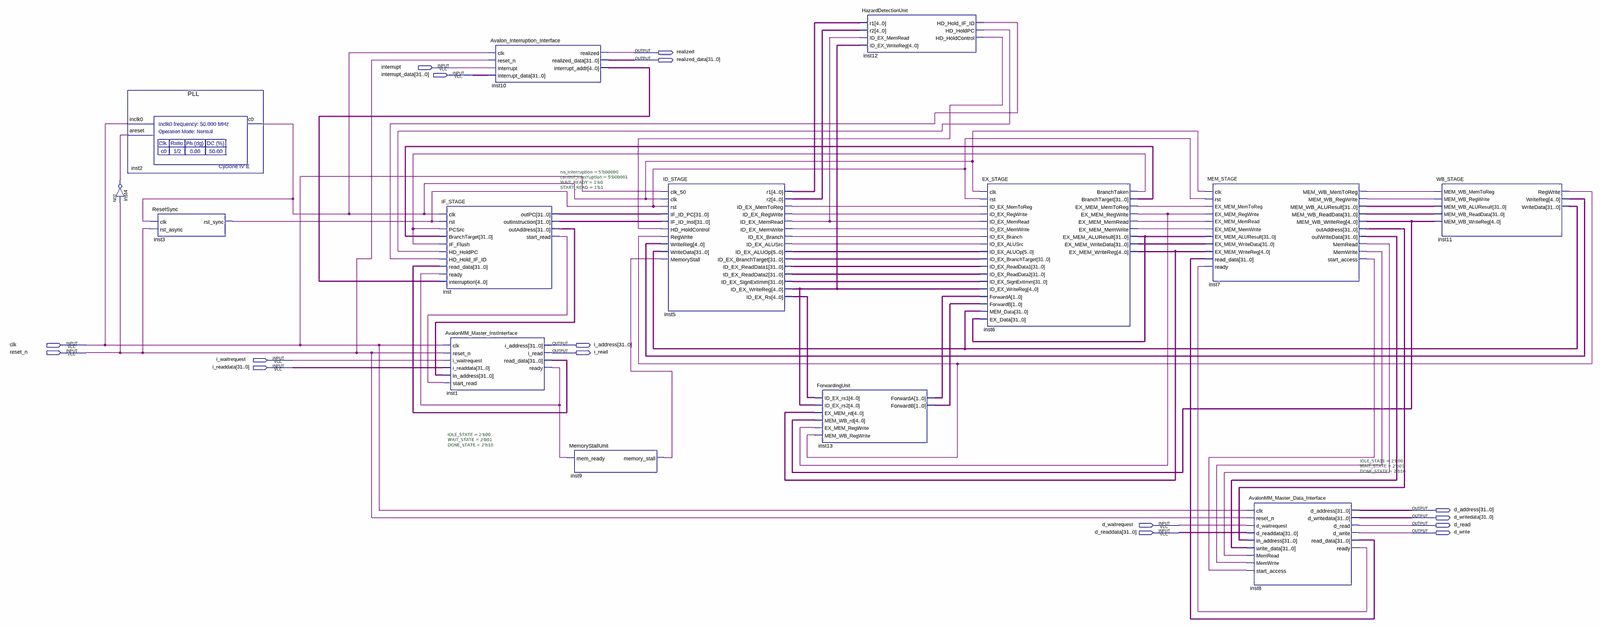
[diagram p0: schematic sheet, whole]
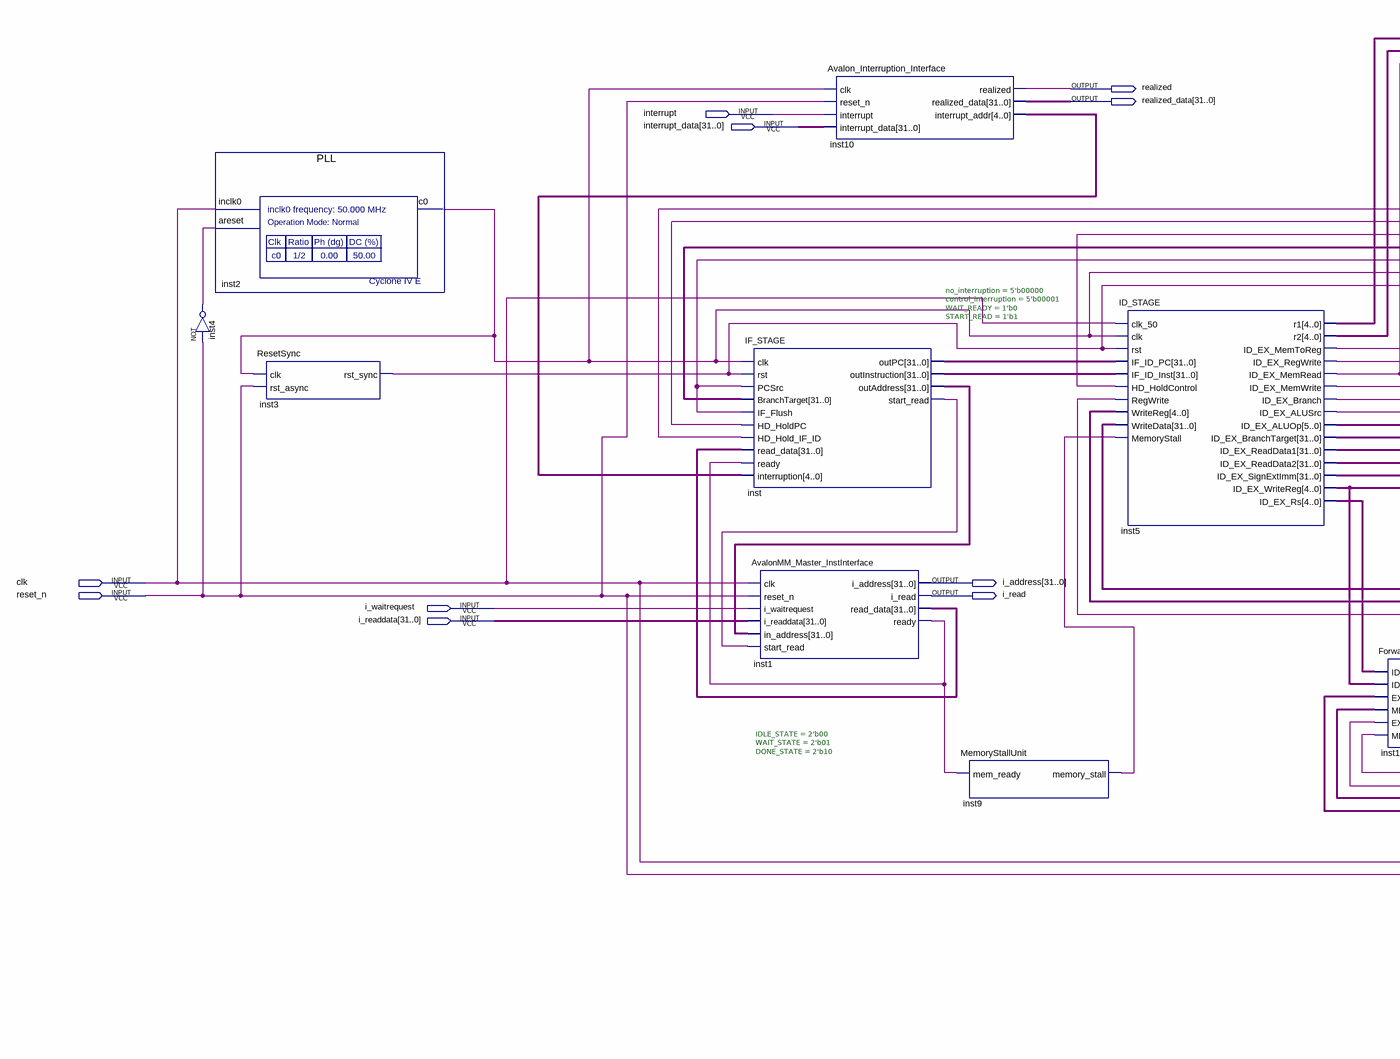
[diagram p1: schematic sheet, left part]
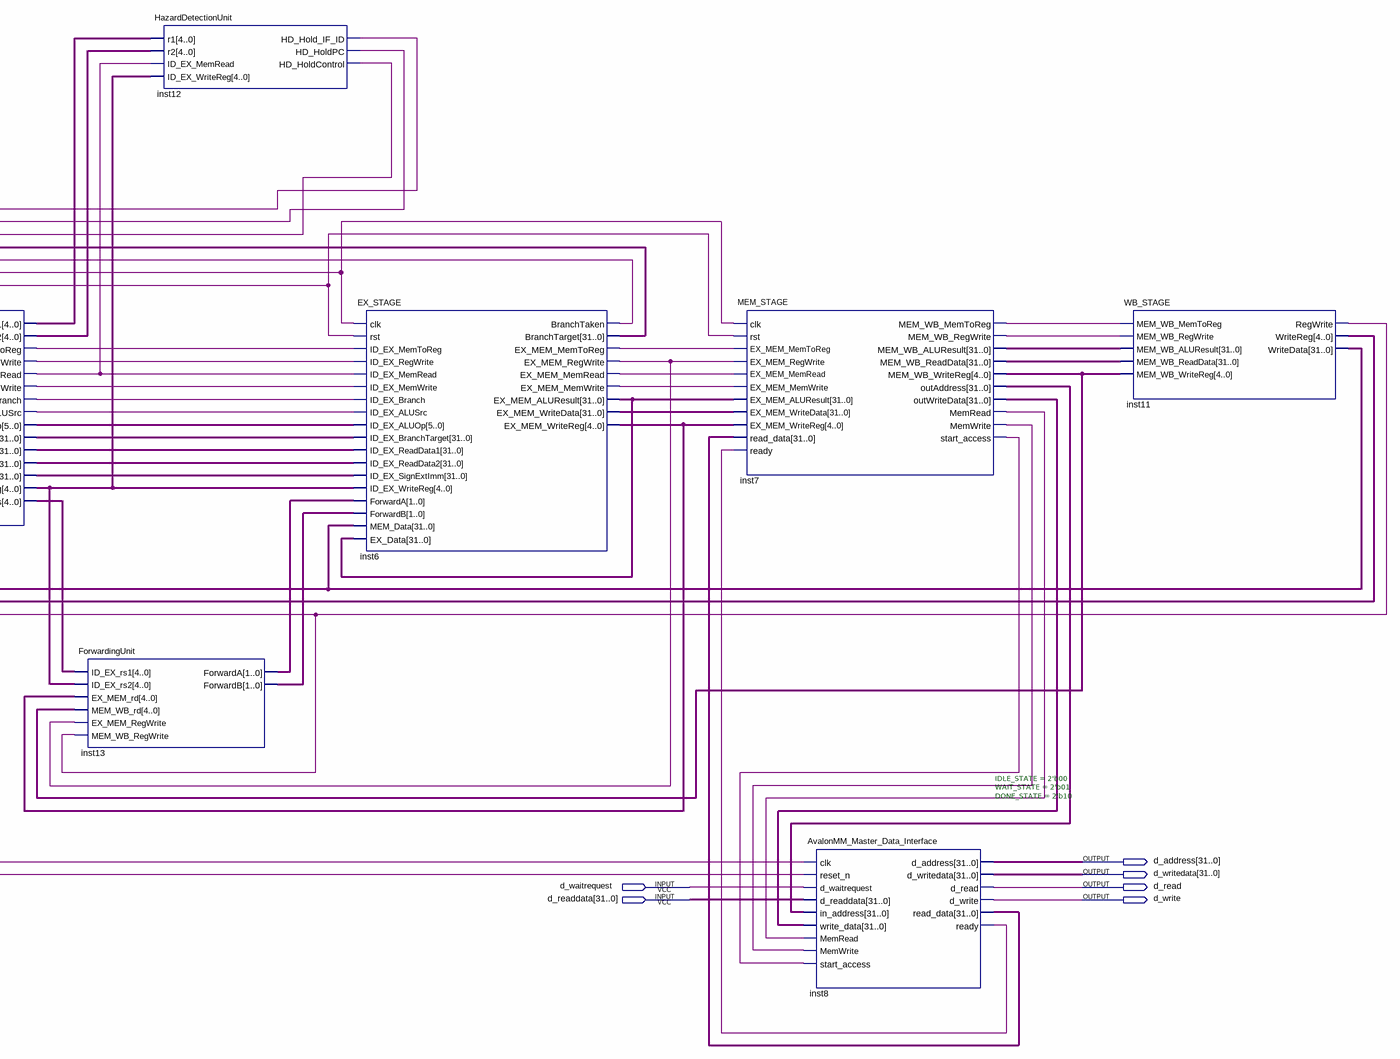
[diagram p2: schematic sheet, right part]
// Quartus schematic CPU.bdf as structural Verilog: 14 symbols, 16 pins
module CPU (
  input  interrupt,
  input  [31:0] interrupt_data,
  input  clk,
  input  reset_n,
  input  i_waitrequest,
  input  [31:0] i_readdata,
  input  d_waitrequest,
  input  [31:0] d_readdata,
  output realized,
  output [31:0] realized_data,
  output [31:0] i_address,
  output i_read,
  output [31:0] d_address,
  output [31:0] d_writedata,
  output d_read,
  output d_write
);

  wire inst1_ready, inst2_c0, inst3_rst_sync, inst4_out, inst5_id_ex_alusrc, inst5_id_ex_branch,
       inst5_id_ex_memread, inst5_id_ex_memtoreg, inst5_id_ex_memwrite, inst5_id_ex_regwrite,
       inst6_branchtaken, inst6_ex_mem_memread, inst6_ex_mem_memtoreg, inst6_ex_mem_memwrite,
       inst6_ex_mem_regwrite, inst7_mem_wb_memtoreg, inst7_mem_wb_regwrite, inst7_memread, inst7_memwrite,
       inst7_start_access, inst8_ready, inst9_memory_stall, inst11_regwrite, inst12_hd_hold_if_id,
       inst12_hd_holdcontrol, inst12_hd_holdpc, inst_start_read;
  wire [1:0] inst13_forwarda, inst13_forwardb;
  wire [4:0] inst5_id_ex_rs, inst5_id_ex_writereg, inst5_r1, inst5_r2, inst6_ex_mem_writereg,
       inst7_mem_wb_writereg, inst10_interrupt_addr, inst11_writereg;
  wire [5:0] inst5_id_ex_aluop;
  wire [31:0] inst1_read_data, inst5_id_ex_branchtarget, inst5_id_ex_readdata1, inst5_id_ex_readdata2,
       inst5_id_ex_signextimm, inst6_branchtarget, inst6_ex_mem_aluresult, inst6_ex_mem_writedata,
       inst7_mem_wb_aluresult, inst7_mem_wb_readdata, inst7_outaddress, inst7_outwritedata, inst8_read_data,
       inst11_writedata, inst_outaddress, inst_outinstruction, inst_outpc;

  PLL inst2 (.inclk0(clk), .areset(inst4_out), .c0(inst2_c0));
  not inst4 (inst4_out, reset_n);
  ResetSync inst3 (.clk(inst2_c0), .rst_async(reset_n), .rst_sync(inst3_rst_sync));
  IF_STAGE #(.no_interruption(5'b00000), .control_interruption(5'b00001), .WAIT_READY(1'b0), .START_READ(1'b1)) inst (
    .clk(inst2_c0), .rst(inst3_rst_sync), .PCSrc(inst6_branchtaken), .BranchTarget(inst6_branchtarget),
    .IF_Flush(inst6_branchtaken), .HD_HoldPC(inst12_hd_holdpc), .HD_Hold_IF_ID(inst12_hd_hold_if_id),
    .read_data(inst1_read_data), .ready(inst1_ready), .interruption(inst10_interrupt_addr),
    .outPC(inst_outpc), .outInstruction(inst_outinstruction), .outAddress(inst_outaddress),
    .start_read(inst_start_read));
  AvalonMM_Master_InstInterface #(.IDLE_STATE(2'b00), .WAIT_STATE(2'b01), .DONE_STATE(2'b10)) inst1 (
    .clk(clk), .reset_n(reset_n), .i_waitrequest(i_waitrequest), .i_readdata(i_readdata),
    .in_address(inst_outaddress), .start_read(inst_start_read), .i_address(i_address), .i_read(i_read),
    .read_data(inst1_read_data), .ready(inst1_ready));
  Avalon_Interruption_Interface inst10 (
    .clk(inst2_c0), .reset_n(reset_n), .interrupt(interrupt), .interrupt_data(interrupt_data),
    .realized(realized), .realized_data(realized_data), .interrupt_addr(inst10_interrupt_addr));
  MemoryStallUnit inst9 (.mem_ready(inst1_ready), .memory_stall(inst9_memory_stall));
  ID_STAGE inst5 (
    .clk_50(clk), .clk(inst2_c0), .rst(inst3_rst_sync), .IF_ID_PC(inst_outpc),
    .IF_ID_Inst(inst_outinstruction), .HD_HoldControl(inst12_hd_holdcontrol), .RegWrite(inst11_regwrite),
    .WriteReg(inst11_writereg), .WriteData(inst11_writedata), .MemoryStall(inst9_memory_stall),
    .r1(inst5_r1), .r2(inst5_r2), .ID_EX_MemToReg(inst5_id_ex_memtoreg),
    .ID_EX_RegWrite(inst5_id_ex_regwrite), .ID_EX_MemRead(inst5_id_ex_memread),
    .ID_EX_MemWrite(inst5_id_ex_memwrite), .ID_EX_Branch(inst5_id_ex_branch),
    .ID_EX_ALUSrc(inst5_id_ex_alusrc), .ID_EX_ALUOp(inst5_id_ex_aluop),
    .ID_EX_BranchTarget(inst5_id_ex_branchtarget), .ID_EX_ReadData1(inst5_id_ex_readdata1),
    .ID_EX_ReadData2(inst5_id_ex_readdata2), .ID_EX_SignExtImm(inst5_id_ex_signextimm),
    .ID_EX_WriteReg(inst5_id_ex_writereg), .ID_EX_Rs(inst5_id_ex_rs));
  ForwardingUnit inst13 (
    .ID_EX_rs1(inst5_id_ex_rs), .ID_EX_rs2(inst5_id_ex_writereg), .EX_MEM_rd(inst6_ex_mem_writereg),
    .MEM_WB_rd(inst7_mem_wb_writereg), .EX_MEM_RegWrite(inst6_ex_mem_regwrite),
    .MEM_WB_RegWrite(inst11_regwrite), .ForwardA(inst13_forwarda), .ForwardB(inst13_forwardb));
  HazardDetectionUnit inst12 (
    .r1(inst5_r1), .r2(inst5_r2), .ID_EX_MemRead(inst5_id_ex_memread), .ID_EX_WriteReg(inst5_id_ex_writereg),
    .HD_Hold_IF_ID(inst12_hd_hold_if_id), .HD_HoldPC(inst12_hd_holdpc), .HD_HoldControl(inst12_hd_holdcontrol));
  EX_STAGE inst6 (
    .clk(inst2_c0), .rst(inst3_rst_sync), .ID_EX_MemToReg(inst5_id_ex_memtoreg),
    .ID_EX_RegWrite(inst5_id_ex_regwrite), .ID_EX_MemRead(inst5_id_ex_memread),
    .ID_EX_MemWrite(inst5_id_ex_memwrite), .ID_EX_Branch(inst5_id_ex_branch),
    .ID_EX_ALUSrc(inst5_id_ex_alusrc), .ID_EX_ALUOp(inst5_id_ex_aluop),
    .ID_EX_BranchTarget(inst5_id_ex_branchtarget), .ID_EX_ReadData1(inst5_id_ex_readdata1),
    .ID_EX_ReadData2(inst5_id_ex_readdata2), .ID_EX_SignExtImm(inst5_id_ex_signextimm),
    .ID_EX_WriteReg(inst5_id_ex_writereg), .ForwardA(inst13_forwarda), .ForwardB(inst13_forwardb),
    .MEM_Data(inst11_writedata), .EX_Data(inst6_ex_mem_aluresult), .BranchTaken(inst6_branchtaken),
    .BranchTarget(inst6_branchtarget), .EX_MEM_MemToReg(inst6_ex_mem_memtoreg),
    .EX_MEM_RegWrite(inst6_ex_mem_regwrite), .EX_MEM_MemRead(inst6_ex_mem_memread),
    .EX_MEM_MemWrite(inst6_ex_mem_memwrite), .EX_MEM_ALUResult(inst6_ex_mem_aluresult),
    .EX_MEM_WriteData(inst6_ex_mem_writedata), .EX_MEM_WriteReg(inst6_ex_mem_writereg));
  MEM_STAGE inst7 (
    .clk(inst2_c0), .rst(inst3_rst_sync), .EX_MEM_MemToReg(inst6_ex_mem_memtoreg),
    .EX_MEM_RegWrite(inst6_ex_mem_regwrite), .EX_MEM_MemRead(inst6_ex_mem_memread),
    .EX_MEM_MemWrite(inst6_ex_mem_memwrite), .EX_MEM_ALUResult(inst6_ex_mem_aluresult),
    .EX_MEM_WriteData(inst6_ex_mem_writedata), .EX_MEM_WriteReg(inst6_ex_mem_writereg),
    .read_data(inst8_read_data), .ready(inst8_ready), .MEM_WB_MemToReg(inst7_mem_wb_memtoreg),
    .MEM_WB_RegWrite(inst7_mem_wb_regwrite), .MEM_WB_ALUResult(inst7_mem_wb_aluresult),
    .MEM_WB_ReadData(inst7_mem_wb_readdata), .MEM_WB_WriteReg(inst7_mem_wb_writereg),
    .outAddress(inst7_outaddress), .outWriteData(inst7_outwritedata), .MemRead(inst7_memread),
    .MemWrite(inst7_memwrite), .start_access(inst7_start_access));
  AvalonMM_Master_Data_Interface #(.IDLE_STATE(2'b00), .WAIT_STATE(2'b01), .DONE_STATE(2'b10)) inst8 (
    .clk(clk), .reset_n(reset_n), .d_waitrequest(d_waitrequest), .d_readdata(d_readdata),
    .in_address(inst7_outaddress), .write_data(inst7_outwritedata), .MemRead(inst7_memread),
    .MemWrite(inst7_memwrite), .start_access(inst7_start_access), .d_address(d_address),
    .d_writedata(d_writedata), .d_read(d_read), .d_write(d_write), .read_data(inst8_read_data),
    .ready(inst8_ready));
  WB_STAGE inst11 (
    .MEM_WB_MemToReg(inst7_mem_wb_memtoreg), .MEM_WB_RegWrite(inst7_mem_wb_regwrite),
    .MEM_WB_ALUResult(inst7_mem_wb_aluresult), .MEM_WB_ReadData(inst7_mem_wb_readdata),
    .MEM_WB_WriteReg(inst7_mem_wb_writereg), .RegWrite(inst11_regwrite), .WriteReg(inst11_writereg),
    .WriteData(inst11_writedata));
endmodule
